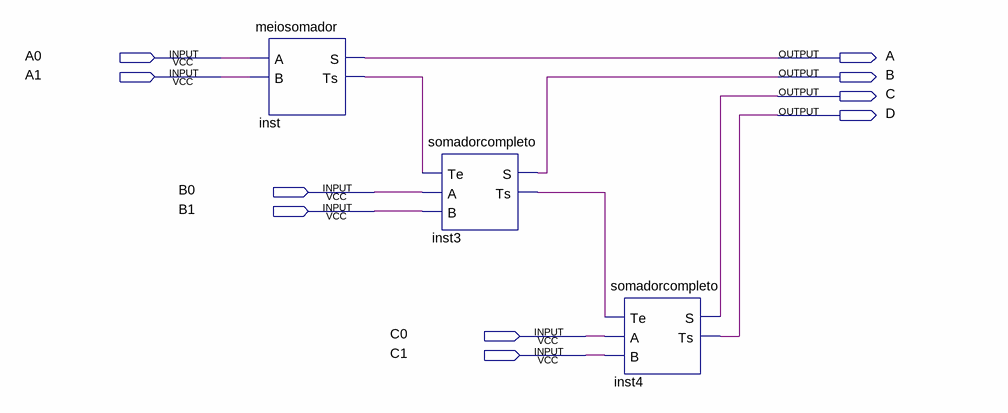
[diagram p0: schematic sheet]
// Quartus schematic somador3bit.bdf as structural Verilog: 3 symbols, 10 pins
module somador3bit (
  input  A0,
  input  A1,
  input  B0,
  input  B1,
  input  C0,
  input  C1,
  output A,
  output B,
  output C,
  output D
);

  wire inst3_ts, inst_ts;

  meiosomador inst (.A(A0), .B(A1), .S(A), .Ts(inst_ts));
  somadorcompleto inst3 (.Te(inst_ts), .A(B0), .B(B1), .S(B), .Ts(inst3_ts));
  somadorcompleto inst4 (.Te(inst3_ts), .A(C0), .B(C1), .S(C), .Ts(D));
endmodule
